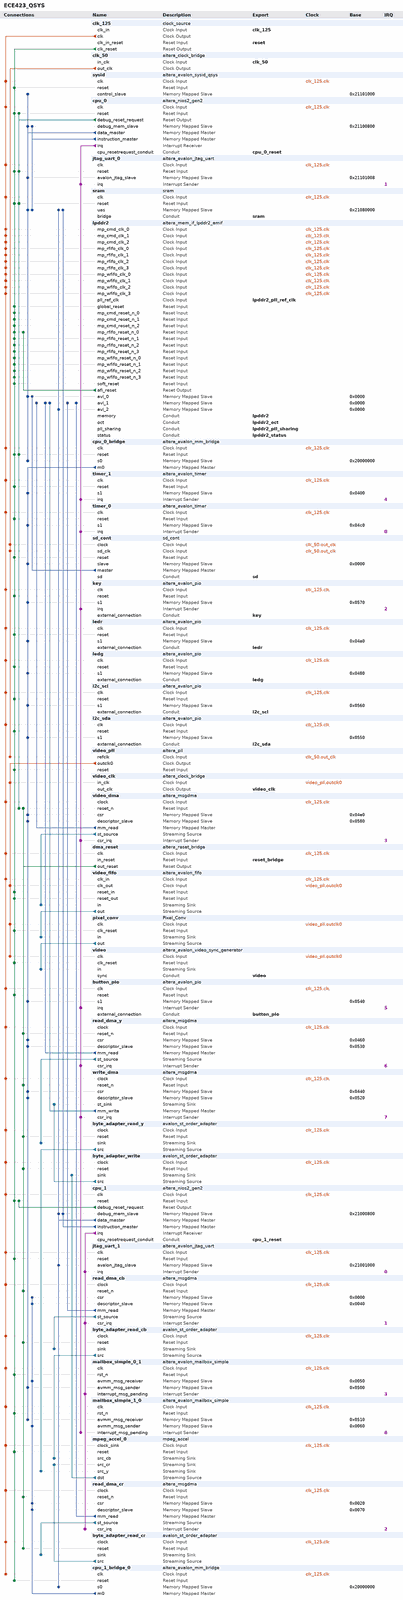
[diagram p0: system contents, whole]
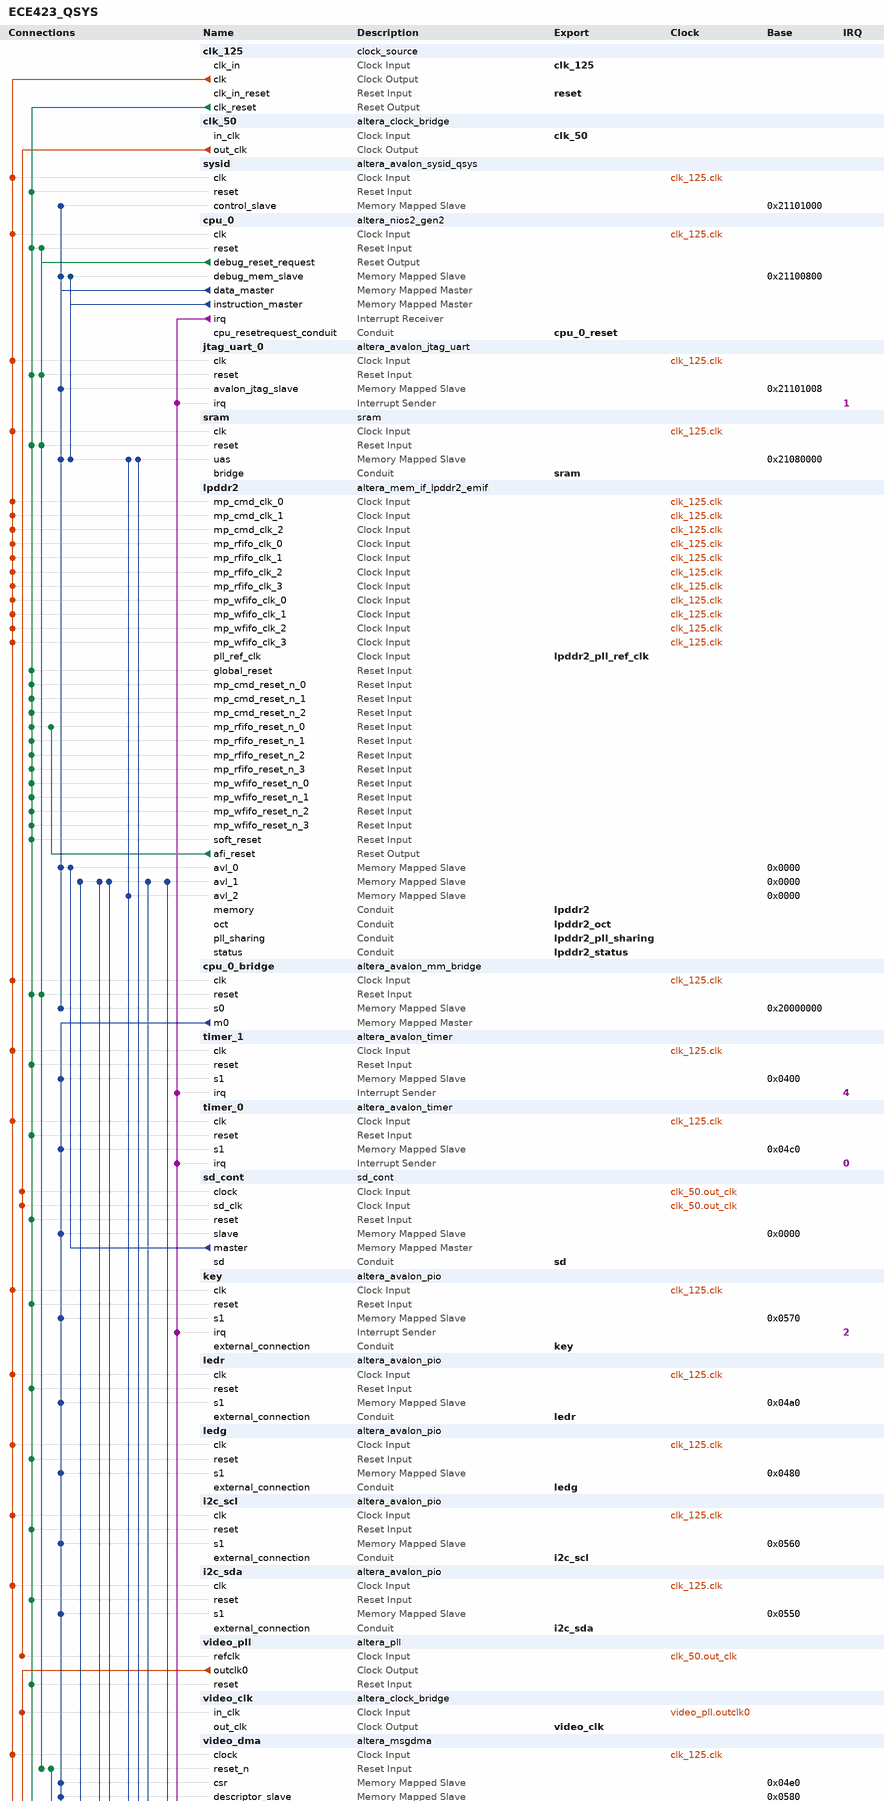
[diagram p1: system contents, upper part]
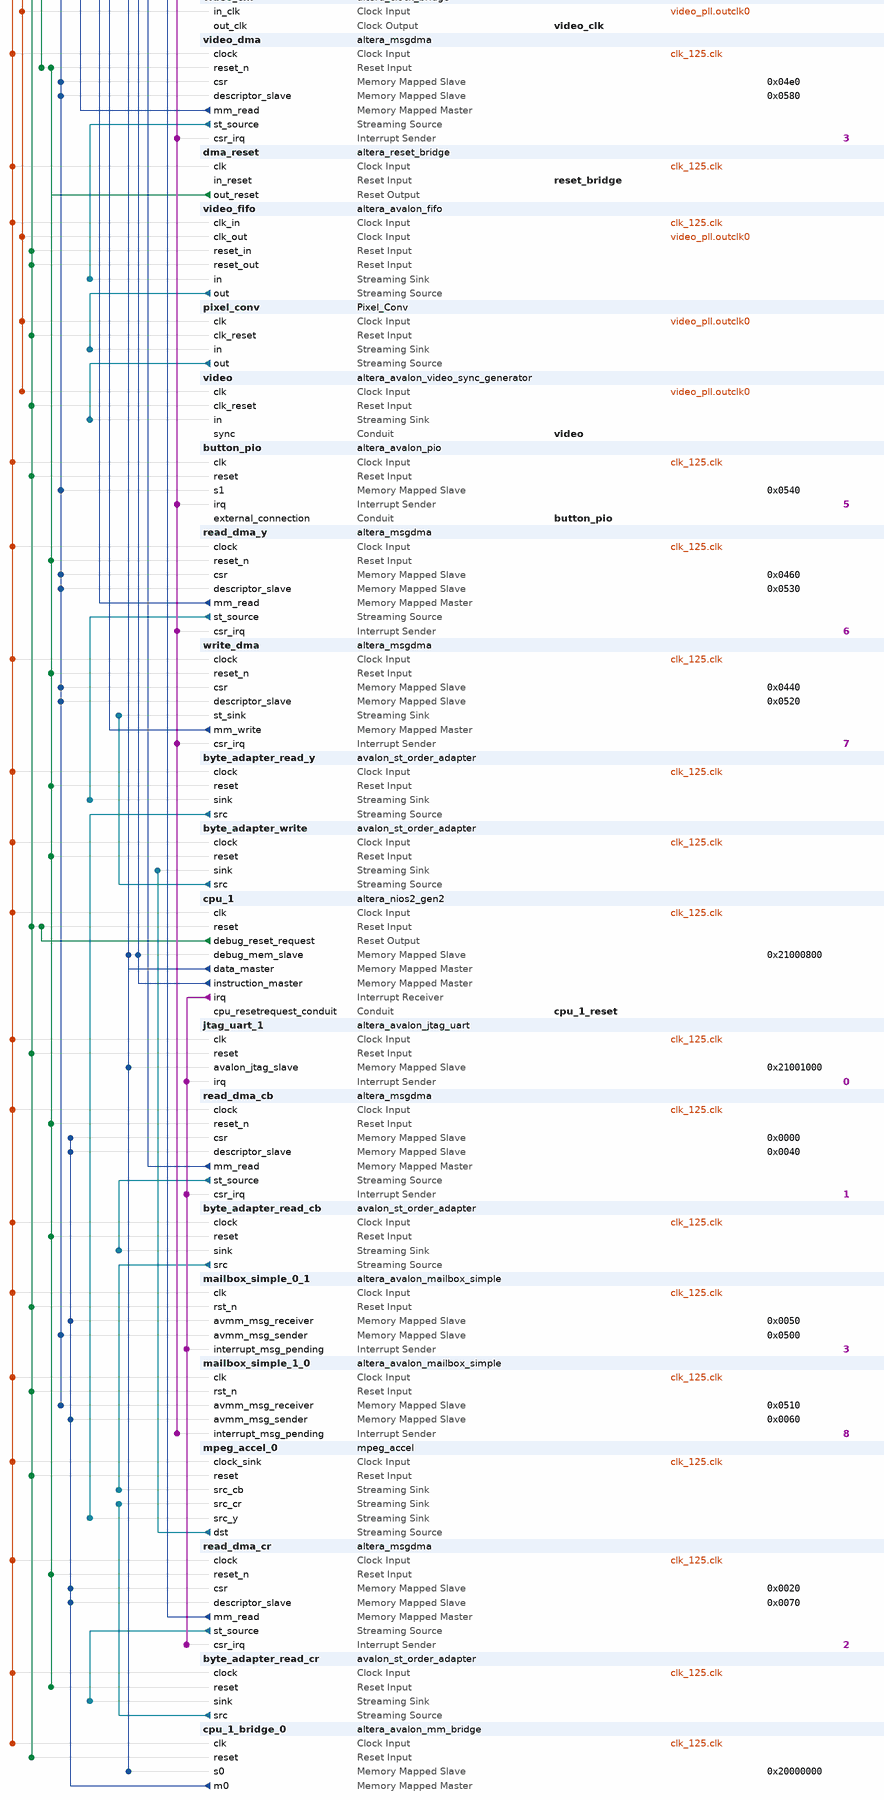
[diagram p2: system contents, lower part]
# Platform Designer (Qsys) system ECE423_QSYS, Cyclone V 5CGXFC5C6F27C7
# Parameters at their usual value, and those the tool derives, are not listed.
package require -exact qsys 15.1
create_system ECE423_QSYS
set_project_property DEVICE_FAMILY {Cyclone V}
set_project_property DEVICE 5CGXFC5C6F27C7

add_instance clk_125 clock_source 15.1
set_instance_parameter_value clk_125 clockFrequency 125000000

add_instance clk_50 altera_clock_bridge 15.1
set_instance_parameter_value clk_50 DERIVED_CLOCK_RATE 0
set_instance_parameter_value clk_50 EXPLICIT_CLOCK_RATE 0

add_instance sysid altera_avalon_sysid_qsys 15.1
set_instance_parameter_value sysid id 0

add_instance cpu_0 altera_nios2_gen2 15.1
set_instance_parameter_value cpu_0 cpuReset true
set_instance_parameter_value cpu_0 dcache_bursts true
set_instance_parameter_value cpu_0 dcache_size 16384
set_instance_parameter_value cpu_0 dividerType srt2
set_instance_parameter_value cpu_0 exceptionSlave sram_memory.uas
set_instance_parameter_value cpu_0 icache_size 4096
set_instance_parameter_value cpu_0 impl Fast
set_instance_parameter_value cpu_0 resetSlave sram_memory.uas
set_instance_parameter_value cpu_0 setting_activateTrace true

add_instance jtag_uart_0 altera_avalon_jtag_uart 15.1
set_instance_parameter_value jtag_uart_0 simInteractiveOptions NO_INTERACTIVE_WINDOWS

add_instance sram sram 1.0

add_instance lpddr2 altera_mem_if_lpddr2_emif 15.1
set_instance_parameter_value lpddr2 ABSTRACT_REAL_COMPARE_TEST false
set_instance_parameter_value lpddr2 ABS_RAM_MEM_INIT_FILENAME meminit
set_instance_parameter_value lpddr2 ACV_PHY_CLK_ADD_FR_PHASE 0.0
set_instance_parameter_value lpddr2 AC_PACKAGE_DESKEW false
set_instance_parameter_value lpddr2 AC_ROM_USER_ADD_0 0_0000_0000_0000
set_instance_parameter_value lpddr2 AC_ROM_USER_ADD_1 0_0000_0000_1000
set_instance_parameter_value lpddr2 ADDR_ORDER 0
set_instance_parameter_value lpddr2 ADD_EFFICIENCY_MONITOR false
set_instance_parameter_value lpddr2 ADD_EXTERNAL_SEQ_DEBUG_NIOS false
set_instance_parameter_value lpddr2 ADVANCED_CK_PHASES false
set_instance_parameter_value lpddr2 ADVERTIZE_SEQUENCER_SW_BUILD_FILES false
set_instance_parameter_value lpddr2 AFI_DEBUG_INFO_WIDTH 32
set_instance_parameter_value lpddr2 ALTMEMPHY_COMPATIBLE_MODE false
set_instance_parameter_value lpddr2 AP_MODE false
set_instance_parameter_value lpddr2 AP_MODE_EN 0
set_instance_parameter_value lpddr2 AVL_DATA_WIDTH_PORT 32,128,32,128,32,32
set_instance_parameter_value lpddr2 AVL_MAX_SIZE 128
set_instance_parameter_value lpddr2 BYTE_ENABLE true
set_instance_parameter_value lpddr2 C2P_WRITE_CLOCK_ADD_PHASE 0.0
set_instance_parameter_value lpddr2 CALIBRATION_MODE Full
set_instance_parameter_value lpddr2 CALIB_REG_WIDTH 8
set_instance_parameter_value lpddr2 CFG_DATA_REORDERING_TYPE INTER_BANK
set_instance_parameter_value lpddr2 CFG_REORDER_DATA true
set_instance_parameter_value lpddr2 CFG_TCCD_NS 2.5
set_instance_parameter_value lpddr2 COMMAND_PHASE 0.0
set_instance_parameter_value lpddr2 CONTROLLER_LATENCY 5
set_instance_parameter_value lpddr2 CORE_DEBUG_CONNECTION EXPORT
set_instance_parameter_value lpddr2 CPORT_TYPE_PORT Bidirectional,Bidirectional,Bidirectional,Read-only,Bidirectional,Bidirectional
set_instance_parameter_value lpddr2 CTL_AUTOPCH_EN false
set_instance_parameter_value lpddr2 CTL_CMD_QUEUE_DEPTH 8
set_instance_parameter_value lpddr2 CTL_CSR_CONNECTION INTERNAL_JTAG
set_instance_parameter_value lpddr2 CTL_CSR_ENABLED false
set_instance_parameter_value lpddr2 CTL_CSR_READ_ONLY 1
set_instance_parameter_value lpddr2 CTL_DEEP_POWERDN_EN false
set_instance_parameter_value lpddr2 CTL_DYNAMIC_BANK_ALLOCATION false
set_instance_parameter_value lpddr2 CTL_DYNAMIC_BANK_NUM 4
set_instance_parameter_value lpddr2 CTL_ECC_AUTO_CORRECTION_ENABLED false
set_instance_parameter_value lpddr2 CTL_ECC_ENABLED false
set_instance_parameter_value lpddr2 CTL_ENABLE_BURST_INTERRUPT false
set_instance_parameter_value lpddr2 CTL_ENABLE_BURST_TERMINATE false
set_instance_parameter_value lpddr2 CTL_HRB_ENABLED false
set_instance_parameter_value lpddr2 CTL_LOOK_AHEAD_DEPTH 4
set_instance_parameter_value lpddr2 CTL_SELF_REFRESH_EN false
set_instance_parameter_value lpddr2 CTL_USR_REFRESH_EN false
set_instance_parameter_value lpddr2 CTL_ZQCAL_EN false
set_instance_parameter_value lpddr2 CUT_NEW_FAMILY_TIMING true
set_instance_parameter_value lpddr2 DAT_DATA_WIDTH 32
set_instance_parameter_value lpddr2 DEBUG_MODE false
set_instance_parameter_value lpddr2 DEVICE_DEPTH 1
set_instance_parameter_value lpddr2 DISABLE_CHILD_MESSAGING false
set_instance_parameter_value lpddr2 DISCRETE_FLY_BY true
set_instance_parameter_value lpddr2 DLL_SHARING_MODE None
set_instance_parameter_value lpddr2 DQS_DQSN_MODE DIFFERENTIAL
set_instance_parameter_value lpddr2 DQ_INPUT_REG_USE_CLKN false
set_instance_parameter_value lpddr2 DUPLICATE_AC false
set_instance_parameter_value lpddr2 ED_EXPORT_SEQ_DEBUG false
set_instance_parameter_value lpddr2 ENABLE_ABS_RAM_MEM_INIT false
set_instance_parameter_value lpddr2 ENABLE_BONDING false
set_instance_parameter_value lpddr2 ENABLE_BURST_MERGE false
set_instance_parameter_value lpddr2 ENABLE_CTRL_AVALON_INTERFACE true
set_instance_parameter_value lpddr2 ENABLE_DELAY_CHAIN_WRITE false
set_instance_parameter_value lpddr2 ENABLE_EMIT_BFM_MASTER false
set_instance_parameter_value lpddr2 ENABLE_EXPORT_SEQ_DEBUG_BRIDGE false
set_instance_parameter_value lpddr2 ENABLE_EXTRA_REPORTING false
set_instance_parameter_value lpddr2 ENABLE_ISS_PROBES false
set_instance_parameter_value lpddr2 ENABLE_NON_DESTRUCTIVE_CALIB false
set_instance_parameter_value lpddr2 ENABLE_NON_DES_CAL false
set_instance_parameter_value lpddr2 ENABLE_NON_DES_CAL_TEST false
set_instance_parameter_value lpddr2 ENABLE_SEQUENCER_MARGINING_ON_BY_DEFAULT false
set_instance_parameter_value lpddr2 ENABLE_USER_ECC false
set_instance_parameter_value lpddr2 EXPORT_AFI_HALF_CLK false
set_instance_parameter_value lpddr2 FORCED_NON_LDC_ADDR_CMD_MEM_CK_INVERT false
set_instance_parameter_value lpddr2 FORCED_NUM_WRITE_FR_CYCLE_SHIFTS 0
set_instance_parameter_value lpddr2 FORCE_DQS_TRACKING AUTO
set_instance_parameter_value lpddr2 FORCE_MAX_LATENCY_COUNT_WIDTH 0
set_instance_parameter_value lpddr2 FORCE_SEQUENCER_TCL_DEBUG_MODE false
set_instance_parameter_value lpddr2 FORCE_SHADOW_REGS AUTO
set_instance_parameter_value lpddr2 HARD_EMIF true
set_instance_parameter_value lpddr2 HCX_COMPAT_MODE false
set_instance_parameter_value lpddr2 HHP_HPS false
set_instance_parameter_value lpddr2 HHP_HPS_SIMULATION false
set_instance_parameter_value lpddr2 HHP_HPS_VERIFICATION false
set_instance_parameter_value lpddr2 HPS_PROTOCOL DEFAULT
set_instance_parameter_value lpddr2 INCLUDE_BOARD_DELAY_MODEL false
set_instance_parameter_value lpddr2 INCLUDE_MULTIRANK_BOARD_DELAY_MODEL false
set_instance_parameter_value lpddr2 IS_ES_DEVICE false
set_instance_parameter_value lpddr2 LOCAL_ID_WIDTH 8
set_instance_parameter_value lpddr2 MARGIN_VARIATION_TEST false
set_instance_parameter_value lpddr2 MAX_PENDING_RD_CMD 16
set_instance_parameter_value lpddr2 MAX_PENDING_WR_CMD 8
set_instance_parameter_value lpddr2 MEM_ATCL 0
set_instance_parameter_value lpddr2 MEM_AUTO_LEVELING_MODE true
set_instance_parameter_value lpddr2 MEM_BANKADDR_WIDTH 3
set_instance_parameter_value lpddr2 MEM_BL 8
set_instance_parameter_value lpddr2 MEM_BT Sequential
set_instance_parameter_value lpddr2 MEM_CK_PHASE 0.0
set_instance_parameter_value lpddr2 MEM_CK_WIDTH 1
set_instance_parameter_value lpddr2 MEM_CLK_EN_WIDTH 1
set_instance_parameter_value lpddr2 MEM_CLK_FREQ 330.0
set_instance_parameter_value lpddr2 MEM_CLK_FREQ_MAX 400.0
set_instance_parameter_value lpddr2 MEM_COL_ADDR_WIDTH 10
set_instance_parameter_value lpddr2 MEM_CS_WIDTH 1
set_instance_parameter_value lpddr2 MEM_DEVICE MISSING_MODEL
set_instance_parameter_value lpddr2 MEM_DLL_EN true
set_instance_parameter_value lpddr2 MEM_DQ_PER_DQS 8
set_instance_parameter_value lpddr2 MEM_DQ_WIDTH 32
set_instance_parameter_value lpddr2 MEM_DRV_STR 40
set_instance_parameter_value lpddr2 MEM_FORMAT DISCRETE
set_instance_parameter_value lpddr2 MEM_GUARANTEED_WRITE_INIT false
set_instance_parameter_value lpddr2 MEM_IF_BOARD_BASE_DELAY 10
set_instance_parameter_value lpddr2 MEM_IF_DM_PINS_EN true
set_instance_parameter_value lpddr2 MEM_IF_DQSN_EN true
set_instance_parameter_value lpddr2 MEM_IF_SIM_VALID_WINDOW 0
set_instance_parameter_value lpddr2 MEM_INIT_EN false
set_instance_parameter_value lpddr2 MEM_MIRROR_ADDRESSING 0
set_instance_parameter_value lpddr2 MEM_NUMBER_OF_DIMMS 1
set_instance_parameter_value lpddr2 MEM_NUMBER_OF_RANKS_PER_DEVICE 1
set_instance_parameter_value lpddr2 MEM_NUMBER_OF_RANKS_PER_DIMM 1
set_instance_parameter_value lpddr2 MEM_RANK_MULTIPLICATION_FACTOR 1
set_instance_parameter_value lpddr2 MEM_ROW_ADDR_WIDTH 14
set_instance_parameter_value lpddr2 MEM_TCL 7
set_instance_parameter_value lpddr2 MEM_TFAW_NS 50.0
set_instance_parameter_value lpddr2 MEM_TINIT_US 200
set_instance_parameter_value lpddr2 MEM_TMRD_CK 2
set_instance_parameter_value lpddr2 MEM_TRAS_NS 70.0
set_instance_parameter_value lpddr2 MEM_TRCD_NS 18.0
set_instance_parameter_value lpddr2 MEM_TREFI_US 3.9
set_instance_parameter_value lpddr2 MEM_TRFC_NS 60.0
set_instance_parameter_value lpddr2 MEM_TRP_NS 18.0
set_instance_parameter_value lpddr2 MEM_TRRD_NS 10.0
set_instance_parameter_value lpddr2 MEM_TRTP_NS 7.5
set_instance_parameter_value lpddr2 MEM_TWR_NS 15.0
set_instance_parameter_value lpddr2 MEM_TWTR 2
set_instance_parameter_value lpddr2 MEM_USER_LEVELING_MODE Leveling
set_instance_parameter_value lpddr2 MEM_VENDOR Micron
set_instance_parameter_value lpddr2 MEM_VERBOSE true
set_instance_parameter_value lpddr2 MRS_MIRROR_PING_PONG_ATSO false
set_instance_parameter_value lpddr2 MULTICAST_EN false
set_instance_parameter_value lpddr2 NEXTGEN true
set_instance_parameter_value lpddr2 NIOS_ROM_DATA_WIDTH 32
set_instance_parameter_value lpddr2 NUM_DLL_SHARING_INTERFACES 1
set_instance_parameter_value lpddr2 NUM_EXTRA_REPORT_PATH 10
set_instance_parameter_value lpddr2 NUM_OCT_SHARING_INTERFACES 1
set_instance_parameter_value lpddr2 NUM_OF_PORTS 3
set_instance_parameter_value lpddr2 NUM_PLL_SHARING_INTERFACES 1
set_instance_parameter_value lpddr2 OCT_SHARING_MODE None
set_instance_parameter_value lpddr2 P2C_READ_CLOCK_ADD_PHASE 0.0
set_instance_parameter_value lpddr2 PACKAGE_DESKEW false
set_instance_parameter_value lpddr2 PARSE_FRIENDLY_DEVICE_FAMILY_PARAM_VALID false
set_instance_parameter_value lpddr2 PHY_CSR_CONNECTION INTERNAL_JTAG
set_instance_parameter_value lpddr2 PHY_CSR_ENABLED false
set_instance_parameter_value lpddr2 PHY_ONLY false
set_instance_parameter_value lpddr2 PINGPONGPHY_EN false
set_instance_parameter_value lpddr2 PLL_ADDR_CMD_CLK_DIV_PARAM 0
set_instance_parameter_value lpddr2 PLL_ADDR_CMD_CLK_FREQ_PARAM 0.0
set_instance_parameter_value lpddr2 PLL_ADDR_CMD_CLK_MULT_PARAM 0
set_instance_parameter_value lpddr2 PLL_ADDR_CMD_CLK_PHASE_PS_PARAM 0
set_instance_parameter_value lpddr2 PLL_AFI_CLK_DIV_PARAM 0
set_instance_parameter_value lpddr2 PLL_AFI_CLK_FREQ_PARAM 0.0
set_instance_parameter_value lpddr2 PLL_AFI_CLK_MULT_PARAM 0
set_instance_parameter_value lpddr2 PLL_AFI_CLK_PHASE_PS_PARAM 0
set_instance_parameter_value lpddr2 PLL_AFI_HALF_CLK_DIV_PARAM 0
set_instance_parameter_value lpddr2 PLL_AFI_HALF_CLK_FREQ_PARAM 0.0
set_instance_parameter_value lpddr2 PLL_AFI_HALF_CLK_MULT_PARAM 0
set_instance_parameter_value lpddr2 PLL_AFI_HALF_CLK_PHASE_PS_PARAM 0
set_instance_parameter_value lpddr2 PLL_AFI_PHY_CLK_DIV_PARAM 0
set_instance_parameter_value lpddr2 PLL_AFI_PHY_CLK_FREQ_PARAM 0.0
set_instance_parameter_value lpddr2 PLL_AFI_PHY_CLK_MULT_PARAM 0
set_instance_parameter_value lpddr2 PLL_AFI_PHY_CLK_PHASE_PS_PARAM 0
set_instance_parameter_value lpddr2 PLL_C2P_WRITE_CLK_DIV_PARAM 0
set_instance_parameter_value lpddr2 PLL_C2P_WRITE_CLK_FREQ_PARAM 0.0
set_instance_parameter_value lpddr2 PLL_C2P_WRITE_CLK_MULT_PARAM 0
set_instance_parameter_value lpddr2 PLL_C2P_WRITE_CLK_PHASE_PS_PARAM 0
set_instance_parameter_value lpddr2 PLL_CLK_PARAM_VALID false
set_instance_parameter_value lpddr2 PLL_CONFIG_CLK_DIV_PARAM 0
set_instance_parameter_value lpddr2 PLL_CONFIG_CLK_FREQ_PARAM 0.0
set_instance_parameter_value lpddr2 PLL_CONFIG_CLK_MULT_PARAM 0
set_instance_parameter_value lpddr2 PLL_CONFIG_CLK_PHASE_PS_PARAM 0
set_instance_parameter_value lpddr2 PLL_DR_CLK_DIV_PARAM 0
set_instance_parameter_value lpddr2 PLL_DR_CLK_FREQ_PARAM 0.0
set_instance_parameter_value lpddr2 PLL_DR_CLK_MULT_PARAM 0
set_instance_parameter_value lpddr2 PLL_DR_CLK_PHASE_PS_PARAM 0
set_instance_parameter_value lpddr2 PLL_HR_CLK_DIV_PARAM 0
set_instance_parameter_value lpddr2 PLL_HR_CLK_FREQ_PARAM 0.0
set_instance_parameter_value lpddr2 PLL_HR_CLK_MULT_PARAM 0
set_instance_parameter_value lpddr2 PLL_HR_CLK_PHASE_PS_PARAM 0
set_instance_parameter_value lpddr2 PLL_LOCATION Top_Bottom
set_instance_parameter_value lpddr2 PLL_MEM_CLK_DIV_PARAM 0
set_instance_parameter_value lpddr2 PLL_MEM_CLK_FREQ_PARAM 0.0
set_instance_parameter_value lpddr2 PLL_MEM_CLK_MULT_PARAM 0
set_instance_parameter_value lpddr2 PLL_MEM_CLK_PHASE_PS_PARAM 0
set_instance_parameter_value lpddr2 PLL_NIOS_CLK_DIV_PARAM 0
set_instance_parameter_value lpddr2 PLL_NIOS_CLK_FREQ_PARAM 0.0
set_instance_parameter_value lpddr2 PLL_NIOS_CLK_MULT_PARAM 0
set_instance_parameter_value lpddr2 PLL_NIOS_CLK_PHASE_PS_PARAM 0
set_instance_parameter_value lpddr2 PLL_P2C_READ_CLK_DIV_PARAM 0
set_instance_parameter_value lpddr2 PLL_P2C_READ_CLK_FREQ_PARAM 0.0
set_instance_parameter_value lpddr2 PLL_P2C_READ_CLK_MULT_PARAM 0
set_instance_parameter_value lpddr2 PLL_P2C_READ_CLK_PHASE_PS_PARAM 0
set_instance_parameter_value lpddr2 PLL_SHARING_MODE None
set_instance_parameter_value lpddr2 PLL_WRITE_CLK_DIV_PARAM 0
set_instance_parameter_value lpddr2 PLL_WRITE_CLK_FREQ_PARAM 0.0
set_instance_parameter_value lpddr2 PLL_WRITE_CLK_MULT_PARAM 0
set_instance_parameter_value lpddr2 PLL_WRITE_CLK_PHASE_PS_PARAM 0
set_instance_parameter_value lpddr2 POWER_OF_TWO_BUS false
set_instance_parameter_value lpddr2 PRIORITY_PORT 2,3,1,3,1,1
set_instance_parameter_value lpddr2 RATE Full
set_instance_parameter_value lpddr2 READ_DQ_DQS_CLOCK_SOURCE INVERTED_DQS_BUS
set_instance_parameter_value lpddr2 READ_FIFO_SIZE 8
set_instance_parameter_value lpddr2 REFRESH_BURST_VALIDATION false
set_instance_parameter_value lpddr2 REFRESH_INTERVAL 15000
set_instance_parameter_value lpddr2 REF_CLK_FREQ 50.0
set_instance_parameter_value lpddr2 REF_CLK_FREQ_MAX_PARAM 0.0
set_instance_parameter_value lpddr2 REF_CLK_FREQ_MIN_PARAM 0.0
set_instance_parameter_value lpddr2 REF_CLK_FREQ_PARAM_VALID false
set_instance_parameter_value lpddr2 SEQUENCER_TYPE NIOS
set_instance_parameter_value lpddr2 SEQ_MODE 0
set_instance_parameter_value lpddr2 SKIP_MEM_INIT true
set_instance_parameter_value lpddr2 SOPC_COMPAT_RESET false
set_instance_parameter_value lpddr2 SPEED_GRADE 7
set_instance_parameter_value lpddr2 STARVE_LIMIT 10
set_instance_parameter_value lpddr2 TIMING_BOARD_AC_EYE_REDUCTION_H 0.0
set_instance_parameter_value lpddr2 TIMING_BOARD_AC_EYE_REDUCTION_SU 0.0
set_instance_parameter_value lpddr2 TIMING_BOARD_AC_SKEW 0.02
set_instance_parameter_value lpddr2 TIMING_BOARD_AC_SLEW_RATE 1.0
set_instance_parameter_value lpddr2 TIMING_BOARD_AC_TO_CK_SKEW 0.0
set_instance_parameter_value lpddr2 TIMING_BOARD_CK_CKN_SLEW_RATE 2.0
set_instance_parameter_value lpddr2 TIMING_BOARD_DELTA_DQS_ARRIVAL_TIME 0.0
set_instance_parameter_value lpddr2 TIMING_BOARD_DELTA_READ_DQS_ARRIVAL_TIME 0.0
set_instance_parameter_value lpddr2 TIMING_BOARD_DERATE_METHOD AUTO
set_instance_parameter_value lpddr2 TIMING_BOARD_DQS_DQSN_SLEW_RATE 2.0
set_instance_parameter_value lpddr2 TIMING_BOARD_DQ_EYE_REDUCTION 0.0
set_instance_parameter_value lpddr2 TIMING_BOARD_DQ_SLEW_RATE 1.0
set_instance_parameter_value lpddr2 TIMING_BOARD_DQ_TO_DQS_SKEW 0.0
set_instance_parameter_value lpddr2 TIMING_BOARD_ISI_METHOD AUTO
set_instance_parameter_value lpddr2 TIMING_BOARD_MAX_CK_DELAY 0.33
set_instance_parameter_value lpddr2 TIMING_BOARD_MAX_DQS_DELAY 0.34
set_instance_parameter_value lpddr2 TIMING_BOARD_READ_DQ_EYE_REDUCTION 0.0
set_instance_parameter_value lpddr2 TIMING_BOARD_SKEW_BETWEEN_DIMMS 0.05
set_instance_parameter_value lpddr2 TIMING_BOARD_SKEW_BETWEEN_DQS 0.02
set_instance_parameter_value lpddr2 TIMING_BOARD_SKEW_CKDQS_DIMM_MAX 0.01
set_instance_parameter_value lpddr2 TIMING_BOARD_SKEW_CKDQS_DIMM_MIN -0.01
set_instance_parameter_value lpddr2 TIMING_BOARD_SKEW_WITHIN_DQS 0.02
set_instance_parameter_value lpddr2 TIMING_BOARD_TDH 0.0
set_instance_parameter_value lpddr2 TIMING_BOARD_TDS 0.0
set_instance_parameter_value lpddr2 TIMING_BOARD_TIH 0.0
set_instance_parameter_value lpddr2 TIMING_BOARD_TIS 0.0
set_instance_parameter_value lpddr2 TIMING_TDH 270
set_instance_parameter_value lpddr2 TIMING_TDQSCK 5500
set_instance_parameter_value lpddr2 TIMING_TDQSCKDL 1200
set_instance_parameter_value lpddr2 TIMING_TDQSCKDM 900
set_instance_parameter_value lpddr2 TIMING_TDQSCKDS 450
set_instance_parameter_value lpddr2 TIMING_TDQSH 0.4
set_instance_parameter_value lpddr2 TIMING_TDQSQ 240
set_instance_parameter_value lpddr2 TIMING_TDQSS 1.0
set_instance_parameter_value lpddr2 TIMING_TDS 270
set_instance_parameter_value lpddr2 TIMING_TDSH 0.2
set_instance_parameter_value lpddr2 TIMING_TDSS 0.2
set_instance_parameter_value lpddr2 TIMING_TIH 290
set_instance_parameter_value lpddr2 TIMING_TIS 290
set_instance_parameter_value lpddr2 TIMING_TQHS 280
set_instance_parameter_value lpddr2 TRACKING_ERROR_TEST false
set_instance_parameter_value lpddr2 TRACKING_WATCH_TEST false
set_instance_parameter_value lpddr2 TREFI 35100
set_instance_parameter_value lpddr2 TRFC 350
set_instance_parameter_value lpddr2 USER_DEBUG_LEVEL 0
set_instance_parameter_value lpddr2 USE_AXI_ADAPTOR false
set_instance_parameter_value lpddr2 USE_FAKE_PHY false
set_instance_parameter_value lpddr2 USE_MEM_CLK_FREQ false
set_instance_parameter_value lpddr2 USE_MM_ADAPTOR true
set_instance_parameter_value lpddr2 USE_SEQUENCER_BFM false
set_instance_parameter_value lpddr2 WEIGHT_PORT 0,0,0,0,0,0
set_instance_parameter_value lpddr2 WRBUFFER_ADDR_WIDTH 6

add_instance cpu_0_bridge altera_avalon_mm_bridge 15.1
set_instance_parameter_value cpu_0_bridge ADDRESS_UNITS SYMBOLS
set_instance_parameter_value cpu_0_bridge ADDRESS_WIDTH 10
set_instance_parameter_value cpu_0_bridge DATA_WIDTH 32
set_instance_parameter_value cpu_0_bridge MAX_PENDING_RESPONSES 4
set_instance_parameter_value cpu_0_bridge USE_AUTO_ADDRESS_WIDTH 1

add_instance timer_1 altera_avalon_timer 15.1
set_instance_parameter_value timer_1 counterSize 64
set_instance_parameter_value timer_1 period 1
set_instance_parameter_value timer_1 periodUnits USEC

add_instance timer_0 altera_avalon_timer 15.1
set_instance_parameter_value timer_0 period 1
set_instance_parameter_value timer_0 periodUnits MSEC

add_instance sd_cont sd_cont 1.0

add_instance key altera_avalon_pio 15.1
set_instance_parameter_value key captureEdge true
set_instance_parameter_value key direction Input
set_instance_parameter_value key edgeType FALLING
set_instance_parameter_value key generateIRQ true
set_instance_parameter_value key irqType EDGE
set_instance_parameter_value key width 4

add_instance ledr altera_avalon_pio 15.1
set_instance_parameter_value ledr bitModifyingOutReg true
set_instance_parameter_value ledr direction Output
set_instance_parameter_value ledr width 8

add_instance ledg altera_avalon_pio 15.1
set_instance_parameter_value ledg bitModifyingOutReg true
set_instance_parameter_value ledg direction Output
set_instance_parameter_value ledg width 8

add_instance i2c_scl altera_avalon_pio 15.1
set_instance_parameter_value i2c_scl direction Output
set_instance_parameter_value i2c_scl width 1

add_instance i2c_sda altera_avalon_pio 15.1
set_instance_parameter_value i2c_sda direction Bidir
set_instance_parameter_value i2c_sda width 1

add_instance video_pll altera_pll 15.1
set_instance_parameter_value video_pll gui_device_speed_grade 1
set_instance_parameter_value video_pll gui_number_of_clocks 1
set_instance_parameter_value video_pll gui_operation_mode direct
set_instance_parameter_value video_pll gui_output_clock_frequency0 25.175
set_instance_parameter_value video_pll gui_pll_mode {Integer-N PLL}
set_instance_parameter_value video_pll gui_reference_clock_frequency 50.0
set_instance_parameter_value video_pll gui_use_locked false

add_instance video_clk altera_clock_bridge 15.1
set_instance_parameter_value video_clk DERIVED_CLOCK_RATE 25175644
set_instance_parameter_value video_clk EXPLICIT_CLOCK_RATE 0

add_instance video_dma altera_msgdma 15.1
set_instance_parameter_value video_dma BURST_ENABLE 1
set_instance_parameter_value video_dma BURST_WRAPPING_SUPPORT 1
set_instance_parameter_value video_dma DATA_FIFO_DEPTH 512
set_instance_parameter_value video_dma DATA_WIDTH 128
set_instance_parameter_value video_dma DESCRIPTOR_FIFO_DEPTH 32
set_instance_parameter_value video_dma ENHANCED_FEATURES 0
set_instance_parameter_value video_dma ERROR_ENABLE 0
set_instance_parameter_value video_dma MAX_BURST_COUNT 128
set_instance_parameter_value video_dma MAX_BYTE 2097152
set_instance_parameter_value video_dma MODE 1
set_instance_parameter_value video_dma PACKET_ENABLE 1
set_instance_parameter_value video_dma TRANSFER_TYPE {Full Word Accesses Only}

add_instance dma_reset altera_reset_bridge 15.1
set_instance_parameter_value dma_reset ACTIVE_LOW_RESET 0
set_instance_parameter_value dma_reset SYNCHRONOUS_EDGES deassert

add_instance video_fifo altera_avalon_fifo 15.1
set_instance_parameter_value video_fifo bitsPerSymbol 8
set_instance_parameter_value video_fifo channelWidth 0
set_instance_parameter_value video_fifo errorWidth 0
set_instance_parameter_value video_fifo fifoDepth 256
set_instance_parameter_value video_fifo fifoInputInterfaceOptions AVALONST_SINK
set_instance_parameter_value video_fifo fifoOutputInterfaceOptions AVALONST_SOURCE
set_instance_parameter_value video_fifo singleClockMode false
set_instance_parameter_value video_fifo symbolsPerBeat 4
set_instance_parameter_value video_fifo useIRQ true
set_instance_parameter_value video_fifo usePacket true
set_instance_parameter_value video_fifo useReadControl false
set_instance_parameter_value video_fifo useWriteControl false

add_instance pixel_conv Pixel_Conv 1.0
set_instance_parameter_value pixel_conv SOURCE_SYMBOLS_PER_BEAT 1

add_instance video altera_avalon_video_sync_generator 15.1
set_instance_parameter_value video BEATS_PER_PIXEL 1
set_instance_parameter_value video DATA_STREAM_BIT_WIDTH 24
set_instance_parameter_value video H_BLANK_PIXELS 128
set_instance_parameter_value video H_FRONT_PORCH_PIXELS 24
set_instance_parameter_value video H_SYNC_PULSE_PIXELS 32
set_instance_parameter_value video H_SYNC_PULSE_POLARITY 0
set_instance_parameter_value video NUM_COLUMNS 640
set_instance_parameter_value video NUM_ROWS 480
set_instance_parameter_value video TOTAL_HSCAN_PIXELS 768
set_instance_parameter_value video TOTAL_VSCAN_LINES 525
set_instance_parameter_value video V_BLANK_LINES 45
set_instance_parameter_value video V_FRONT_PORCH_LINES 10
set_instance_parameter_value video V_SYNC_PULSE_LINES 3
set_instance_parameter_value video V_SYNC_PULSE_POLARITY 0

add_instance button_pio altera_avalon_pio 15.1
set_instance_parameter_value button_pio captureEdge true
set_instance_parameter_value button_pio direction Input
set_instance_parameter_value button_pio edgeType ANY
set_instance_parameter_value button_pio generateIRQ true
set_instance_parameter_value button_pio irqType EDGE
set_instance_parameter_value button_pio width 4

add_instance read_dma_y altera_msgdma 15.1
set_instance_parameter_value read_dma_y BURST_ENABLE 1
set_instance_parameter_value read_dma_y DATA_FIFO_DEPTH 512
set_instance_parameter_value read_dma_y DATA_WIDTH 1024
set_instance_parameter_value read_dma_y DESCRIPTOR_FIFO_DEPTH 16
set_instance_parameter_value read_dma_y ENHANCED_FEATURES 0
set_instance_parameter_value read_dma_y ERROR_ENABLE 0
set_instance_parameter_value read_dma_y MAX_BURST_COUNT 4
set_instance_parameter_value read_dma_y MAX_BYTE 1048576
set_instance_parameter_value read_dma_y MODE 1
set_instance_parameter_value read_dma_y PACKET_ENABLE 0
set_instance_parameter_value read_dma_y TRANSFER_TYPE {Full Word Accesses Only}

add_instance write_dma altera_msgdma 15.1
set_instance_parameter_value write_dma BURST_ENABLE 1
set_instance_parameter_value write_dma DATA_FIFO_DEPTH 16
set_instance_parameter_value write_dma DATA_WIDTH 1024
set_instance_parameter_value write_dma DESCRIPTOR_FIFO_DEPTH 128
set_instance_parameter_value write_dma ENHANCED_FEATURES 0
set_instance_parameter_value write_dma ERROR_ENABLE 0
set_instance_parameter_value write_dma MAX_BURST_COUNT 4
set_instance_parameter_value write_dma MAX_BYTE 1048576
set_instance_parameter_value write_dma MODE 2
set_instance_parameter_value write_dma PACKET_ENABLE 0
set_instance_parameter_value write_dma TRANSFER_TYPE {Full Word Accesses Only}

add_instance byte_adapter_read_y avalon_st_order_adapter 1.0
set_instance_parameter_value byte_adapter_read_y Width 1024

add_instance byte_adapter_write avalon_st_order_adapter 1.0
set_instance_parameter_value byte_adapter_write Width 1024

add_instance cpu_1 altera_nios2_gen2 15.1
set_instance_parameter_value cpu_1 cpuReset true
set_instance_parameter_value cpu_1 dcache_bursts true
set_instance_parameter_value cpu_1 dcache_size 16384
set_instance_parameter_value cpu_1 dividerType srt2
set_instance_parameter_value cpu_1 exceptionOffset 262176
set_instance_parameter_value cpu_1 exceptionSlave sram_memory.uas
set_instance_parameter_value cpu_1 icache_size 4096
set_instance_parameter_value cpu_1 impl Fast
set_instance_parameter_value cpu_1 resetOffset 262144
set_instance_parameter_value cpu_1 resetSlave sram_memory.uas
set_instance_parameter_value cpu_1 setting_activateTrace true

add_instance jtag_uart_1 altera_avalon_jtag_uart 15.1
set_instance_parameter_value jtag_uart_1 simInteractiveOptions NO_INTERACTIVE_WINDOWS

add_instance read_dma_cb altera_msgdma 15.1
set_instance_parameter_value read_dma_cb BURST_ENABLE 1
set_instance_parameter_value read_dma_cb DATA_FIFO_DEPTH 512
set_instance_parameter_value read_dma_cb DATA_WIDTH 1024
set_instance_parameter_value read_dma_cb DESCRIPTOR_FIFO_DEPTH 16
set_instance_parameter_value read_dma_cb ENHANCED_FEATURES 0
set_instance_parameter_value read_dma_cb ERROR_ENABLE 0
set_instance_parameter_value read_dma_cb MAX_BURST_COUNT 4
set_instance_parameter_value read_dma_cb MAX_BYTE 1048576
set_instance_parameter_value read_dma_cb MODE 1
set_instance_parameter_value read_dma_cb PACKET_ENABLE 0
set_instance_parameter_value read_dma_cb TRANSFER_TYPE {Full Word Accesses Only}

add_instance byte_adapter_read_cb avalon_st_order_adapter 1.0
set_instance_parameter_value byte_adapter_read_cb Width 1024

add_instance mailbox_simple_0_1 altera_avalon_mailbox_simple 15.1
set_instance_parameter_value mailbox_simple_0_1 AWIDTH 2
set_instance_parameter_value mailbox_simple_0_1 DWIDTH 32
set_instance_parameter_value mailbox_simple_0_1 MSG_ARRIVAL_NOTIFY 1
set_instance_parameter_value mailbox_simple_0_1 MSG_SPACE_NOTIFY 0

add_instance mailbox_simple_1_0 altera_avalon_mailbox_simple 15.1
set_instance_parameter_value mailbox_simple_1_0 AWIDTH 2
set_instance_parameter_value mailbox_simple_1_0 DWIDTH 32
set_instance_parameter_value mailbox_simple_1_0 MSG_ARRIVAL_NOTIFY 1
set_instance_parameter_value mailbox_simple_1_0 MSG_SPACE_NOTIFY 0

add_instance mpeg_accel_0 mpeg_accel 1.0

add_instance read_dma_cr altera_msgdma 15.1
set_instance_parameter_value read_dma_cr BURST_ENABLE 1
set_instance_parameter_value read_dma_cr DATA_FIFO_DEPTH 512
set_instance_parameter_value read_dma_cr DATA_WIDTH 1024
set_instance_parameter_value read_dma_cr DESCRIPTOR_FIFO_DEPTH 16
set_instance_parameter_value read_dma_cr ENHANCED_FEATURES 0
set_instance_parameter_value read_dma_cr ERROR_ENABLE 0
set_instance_parameter_value read_dma_cr MAX_BURST_COUNT 4
set_instance_parameter_value read_dma_cr MAX_BYTE 1048576
set_instance_parameter_value read_dma_cr MODE 1
set_instance_parameter_value read_dma_cr PACKET_ENABLE 0
set_instance_parameter_value read_dma_cr TRANSFER_TYPE {Full Word Accesses Only}

add_instance byte_adapter_read_cr avalon_st_order_adapter 1.0
set_instance_parameter_value byte_adapter_read_cr Width 1024

add_instance cpu_1_bridge_0 altera_avalon_mm_bridge 15.1
set_instance_parameter_value cpu_1_bridge_0 ADDRESS_UNITS SYMBOLS
set_instance_parameter_value cpu_1_bridge_0 ADDRESS_WIDTH 10
set_instance_parameter_value cpu_1_bridge_0 DATA_WIDTH 32
set_instance_parameter_value cpu_1_bridge_0 MAX_PENDING_RESPONSES 4
set_instance_parameter_value cpu_1_bridge_0 USE_AUTO_ADDRESS_WIDTH 1

# connections
add_connection clk_50.out_clk sd_cont.clock clock
add_connection clk_50.out_clk sd_cont.sd_clk clock
add_connection clk_50.out_clk video_pll.refclk clock
add_connection clk_125.clk button_pio.clk clock
add_connection clk_125.clk byte_adapter_read_cb.clock clock
add_connection clk_125.clk byte_adapter_read_cr.clock clock
add_connection clk_125.clk byte_adapter_read_y.clock clock
add_connection clk_125.clk byte_adapter_write.clock clock
add_connection clk_125.clk cpu_0.clk clock
add_connection clk_125.clk cpu_0_bridge.clk clock
add_connection clk_125.clk cpu_1.clk clock
add_connection clk_125.clk cpu_1_bridge_0.clk clock
add_connection clk_125.clk dma_reset.clk clock
add_connection clk_125.clk i2c_scl.clk clock
add_connection clk_125.clk i2c_sda.clk clock
add_connection clk_125.clk jtag_uart_0.clk clock
add_connection clk_125.clk jtag_uart_1.clk clock
add_connection clk_125.clk key.clk clock
add_connection clk_125.clk ledg.clk clock
add_connection clk_125.clk ledr.clk clock
add_connection clk_125.clk lpddr2.mp_cmd_clk_0 clock
add_connection clk_125.clk lpddr2.mp_cmd_clk_1 clock
add_connection clk_125.clk lpddr2.mp_cmd_clk_2 clock
add_connection clk_125.clk lpddr2.mp_rfifo_clk_0 clock
add_connection clk_125.clk lpddr2.mp_rfifo_clk_1 clock
add_connection clk_125.clk lpddr2.mp_rfifo_clk_2 clock
add_connection clk_125.clk lpddr2.mp_rfifo_clk_3 clock
add_connection clk_125.clk lpddr2.mp_wfifo_clk_0 clock
add_connection clk_125.clk lpddr2.mp_wfifo_clk_1 clock
add_connection clk_125.clk lpddr2.mp_wfifo_clk_2 clock
add_connection clk_125.clk lpddr2.mp_wfifo_clk_3 clock
add_connection clk_125.clk mailbox_simple_0_1.clk clock
add_connection clk_125.clk mailbox_simple_1_0.clk clock
add_connection clk_125.clk mpeg_accel_0.clock_sink clock
add_connection clk_125.clk read_dma_cb.clock clock
add_connection clk_125.clk read_dma_cr.clock clock
add_connection clk_125.clk read_dma_y.clock clock
add_connection clk_125.clk sram.clk clock
add_connection clk_125.clk sysid.clk clock
add_connection clk_125.clk timer_0.clk clock
add_connection clk_125.clk timer_1.clk clock
add_connection clk_125.clk video_dma.clock clock
add_connection clk_125.clk video_fifo.clk_in clock
add_connection clk_125.clk write_dma.clock clock
add_connection video_pll.outclk0 pixel_conv.clk clock
add_connection video_pll.outclk0 video.clk clock
add_connection video_pll.outclk0 video_clk.in_clk clock
add_connection video_pll.outclk0 video_fifo.clk_out clock
add_connection clk_125.clk_reset button_pio.reset reset
add_connection clk_125.clk_reset cpu_0.reset reset
add_connection clk_125.clk_reset cpu_0_bridge.reset reset
add_connection clk_125.clk_reset cpu_1.reset reset
add_connection clk_125.clk_reset cpu_1_bridge_0.reset reset
add_connection clk_125.clk_reset i2c_scl.reset reset
add_connection clk_125.clk_reset i2c_sda.reset reset
add_connection clk_125.clk_reset jtag_uart_0.reset reset
add_connection clk_125.clk_reset jtag_uart_1.reset reset
add_connection clk_125.clk_reset key.reset reset
add_connection clk_125.clk_reset ledg.reset reset
add_connection clk_125.clk_reset ledr.reset reset
add_connection clk_125.clk_reset lpddr2.global_reset reset
add_connection clk_125.clk_reset lpddr2.mp_cmd_reset_n_0 reset
add_connection clk_125.clk_reset lpddr2.mp_cmd_reset_n_1 reset
add_connection clk_125.clk_reset lpddr2.mp_cmd_reset_n_2 reset
add_connection clk_125.clk_reset lpddr2.mp_rfifo_reset_n_0 reset
add_connection clk_125.clk_reset lpddr2.mp_rfifo_reset_n_1 reset
add_connection clk_125.clk_reset lpddr2.mp_rfifo_reset_n_2 reset
add_connection clk_125.clk_reset lpddr2.mp_rfifo_reset_n_3 reset
add_connection clk_125.clk_reset lpddr2.mp_wfifo_reset_n_0 reset
add_connection clk_125.clk_reset lpddr2.mp_wfifo_reset_n_1 reset
add_connection clk_125.clk_reset lpddr2.mp_wfifo_reset_n_2 reset
add_connection clk_125.clk_reset lpddr2.mp_wfifo_reset_n_3 reset
add_connection clk_125.clk_reset lpddr2.soft_reset reset
add_connection clk_125.clk_reset mailbox_simple_0_1.rst_n reset
add_connection clk_125.clk_reset mailbox_simple_1_0.rst_n reset
add_connection clk_125.clk_reset mpeg_accel_0.reset reset
add_connection clk_125.clk_reset pixel_conv.clk_reset reset
add_connection clk_125.clk_reset sd_cont.reset reset
add_connection clk_125.clk_reset sram.reset reset
add_connection clk_125.clk_reset sysid.reset reset
add_connection clk_125.clk_reset timer_0.reset reset
add_connection clk_125.clk_reset timer_1.reset reset
add_connection clk_125.clk_reset video.clk_reset reset
add_connection clk_125.clk_reset video_fifo.reset_in reset
add_connection clk_125.clk_reset video_fifo.reset_out reset
add_connection clk_125.clk_reset video_pll.reset reset
add_connection cpu_0.debug_reset_request cpu_0.reset reset
add_connection cpu_0.debug_reset_request cpu_0_bridge.reset reset
add_connection cpu_0.debug_reset_request jtag_uart_0.reset reset
add_connection cpu_0.debug_reset_request sram.reset reset
add_connection cpu_0.debug_reset_request video_dma.reset_n reset
add_connection cpu_1.debug_reset_request cpu_1.reset reset
add_connection dma_reset.out_reset byte_adapter_read_cb.reset reset
add_connection dma_reset.out_reset byte_adapter_read_cr.reset reset
add_connection dma_reset.out_reset byte_adapter_read_y.reset reset
add_connection dma_reset.out_reset byte_adapter_write.reset reset
add_connection dma_reset.out_reset read_dma_cb.reset_n reset
add_connection dma_reset.out_reset read_dma_cr.reset_n reset
add_connection dma_reset.out_reset read_dma_y.reset_n reset
add_connection dma_reset.out_reset video_dma.reset_n reset
add_connection dma_reset.out_reset write_dma.reset_n reset
add_connection lpddr2.afi_reset lpddr2.mp_rfifo_reset_n_0 reset
add_connection cpu_0.data_master cpu_0.debug_mem_slave avalon
set_connection_parameter_value cpu_0.data_master/cpu_0.debug_mem_slave baseAddress 0x21100800
add_connection cpu_0.data_master cpu_0_bridge.s0 avalon
set_connection_parameter_value cpu_0.data_master/cpu_0_bridge.s0 baseAddress 0x20000000
add_connection cpu_0.data_master jtag_uart_0.avalon_jtag_slave avalon
set_connection_parameter_value cpu_0.data_master/jtag_uart_0.avalon_jtag_slave baseAddress 0x21101008
add_connection cpu_0.data_master lpddr2.avl_0 avalon
set_connection_parameter_value cpu_0.data_master/lpddr2.avl_0 baseAddress 0x0000
add_connection cpu_0.data_master sram.uas avalon
set_connection_parameter_value cpu_0.data_master/sram.uas baseAddress 0x21080000
add_connection cpu_0.data_master sysid.control_slave avalon
set_connection_parameter_value cpu_0.data_master/sysid.control_slave baseAddress 0x21101000
add_connection cpu_0.instruction_master cpu_0.debug_mem_slave avalon
set_connection_parameter_value cpu_0.instruction_master/cpu_0.debug_mem_slave baseAddress 0x21100800
add_connection cpu_0.instruction_master sram.uas avalon
set_connection_parameter_value cpu_0.instruction_master/sram.uas baseAddress 0x21080000
add_connection cpu_0_bridge.m0 button_pio.s1 avalon
set_connection_parameter_value cpu_0_bridge.m0/button_pio.s1 baseAddress 0x0540
add_connection cpu_0_bridge.m0 i2c_scl.s1 avalon
set_connection_parameter_value cpu_0_bridge.m0/i2c_scl.s1 baseAddress 0x0560
add_connection cpu_0_bridge.m0 i2c_sda.s1 avalon
set_connection_parameter_value cpu_0_bridge.m0/i2c_sda.s1 baseAddress 0x0550
add_connection cpu_0_bridge.m0 key.s1 avalon
set_connection_parameter_value cpu_0_bridge.m0/key.s1 baseAddress 0x0570
add_connection cpu_0_bridge.m0 ledg.s1 avalon
set_connection_parameter_value cpu_0_bridge.m0/ledg.s1 baseAddress 0x0480
add_connection cpu_0_bridge.m0 ledr.s1 avalon
set_connection_parameter_value cpu_0_bridge.m0/ledr.s1 baseAddress 0x04a0
add_connection cpu_0_bridge.m0 mailbox_simple_0_1.avmm_msg_sender avalon
set_connection_parameter_value cpu_0_bridge.m0/mailbox_simple_0_1.avmm_msg_sender baseAddress 0x0500
add_connection cpu_0_bridge.m0 mailbox_simple_1_0.avmm_msg_receiver avalon
set_connection_parameter_value cpu_0_bridge.m0/mailbox_simple_1_0.avmm_msg_receiver baseAddress 0x0510
add_connection cpu_0_bridge.m0 read_dma_y.csr avalon
set_connection_parameter_value cpu_0_bridge.m0/read_dma_y.csr baseAddress 0x0460
add_connection cpu_0_bridge.m0 read_dma_y.descriptor_slave avalon
set_connection_parameter_value cpu_0_bridge.m0/read_dma_y.descriptor_slave baseAddress 0x0530
add_connection cpu_0_bridge.m0 sd_cont.slave avalon
set_connection_parameter_value cpu_0_bridge.m0/sd_cont.slave baseAddress 0x0000
add_connection cpu_0_bridge.m0 timer_0.s1 avalon
set_connection_parameter_value cpu_0_bridge.m0/timer_0.s1 baseAddress 0x04c0
add_connection cpu_0_bridge.m0 timer_1.s1 avalon
set_connection_parameter_value cpu_0_bridge.m0/timer_1.s1 baseAddress 0x0400
add_connection cpu_0_bridge.m0 video_dma.csr avalon
set_connection_parameter_value cpu_0_bridge.m0/video_dma.csr baseAddress 0x04e0
add_connection cpu_0_bridge.m0 video_dma.descriptor_slave avalon
set_connection_parameter_value cpu_0_bridge.m0/video_dma.descriptor_slave baseAddress 0x0580
add_connection cpu_0_bridge.m0 write_dma.csr avalon
set_connection_parameter_value cpu_0_bridge.m0/write_dma.csr baseAddress 0x0440
add_connection cpu_0_bridge.m0 write_dma.descriptor_slave avalon
set_connection_parameter_value cpu_0_bridge.m0/write_dma.descriptor_slave baseAddress 0x0520
add_connection cpu_1.data_master cpu_1.debug_mem_slave avalon
set_connection_parameter_value cpu_1.data_master/cpu_1.debug_mem_slave baseAddress 0x21000800
add_connection cpu_1.data_master cpu_1_bridge_0.s0 avalon
set_connection_parameter_value cpu_1.data_master/cpu_1_bridge_0.s0 baseAddress 0x20000000
add_connection cpu_1.data_master jtag_uart_1.avalon_jtag_slave avalon
set_connection_parameter_value cpu_1.data_master/jtag_uart_1.avalon_jtag_slave baseAddress 0x21001000
add_connection cpu_1.data_master lpddr2.avl_2 avalon
set_connection_parameter_value cpu_1.data_master/lpddr2.avl_2 baseAddress 0x0000
add_connection cpu_1.data_master sram.uas avalon
set_connection_parameter_value cpu_1.data_master/sram.uas baseAddress 0x21080000
add_connection cpu_1.instruction_master cpu_1.debug_mem_slave avalon
set_connection_parameter_value cpu_1.instruction_master/cpu_1.debug_mem_slave baseAddress 0x21000800
add_connection cpu_1.instruction_master sram.uas avalon
set_connection_parameter_value cpu_1.instruction_master/sram.uas baseAddress 0x21080000
add_connection cpu_1_bridge_0.m0 mailbox_simple_0_1.avmm_msg_receiver avalon
set_connection_parameter_value cpu_1_bridge_0.m0/mailbox_simple_0_1.avmm_msg_receiver baseAddress 0x0050
add_connection cpu_1_bridge_0.m0 mailbox_simple_1_0.avmm_msg_sender avalon
set_connection_parameter_value cpu_1_bridge_0.m0/mailbox_simple_1_0.avmm_msg_sender baseAddress 0x0060
add_connection cpu_1_bridge_0.m0 read_dma_cb.csr avalon
set_connection_parameter_value cpu_1_bridge_0.m0/read_dma_cb.csr baseAddress 0x0000
add_connection cpu_1_bridge_0.m0 read_dma_cb.descriptor_slave avalon
set_connection_parameter_value cpu_1_bridge_0.m0/read_dma_cb.descriptor_slave baseAddress 0x0040
add_connection cpu_1_bridge_0.m0 read_dma_cr.csr avalon
set_connection_parameter_value cpu_1_bridge_0.m0/read_dma_cr.csr baseAddress 0x0020
add_connection cpu_1_bridge_0.m0 read_dma_cr.descriptor_slave avalon
set_connection_parameter_value cpu_1_bridge_0.m0/read_dma_cr.descriptor_slave baseAddress 0x0070
add_connection read_dma_cb.mm_read lpddr2.avl_1 avalon
set_connection_parameter_value read_dma_cb.mm_read/lpddr2.avl_1 baseAddress 0x0000
add_connection read_dma_cr.mm_read lpddr2.avl_1 avalon
set_connection_parameter_value read_dma_cr.mm_read/lpddr2.avl_1 baseAddress 0x0000
add_connection read_dma_y.mm_read lpddr2.avl_1 avalon
set_connection_parameter_value read_dma_y.mm_read/lpddr2.avl_1 baseAddress 0x0000
add_connection sd_cont.master lpddr2.avl_0 avalon
set_connection_parameter_value sd_cont.master/lpddr2.avl_0 baseAddress 0x0000
add_connection video_dma.mm_read lpddr2.avl_1 avalon
set_connection_parameter_value video_dma.mm_read/lpddr2.avl_1 baseAddress 0x0000
add_connection write_dma.mm_write lpddr2.avl_1 avalon
set_connection_parameter_value write_dma.mm_write/lpddr2.avl_1 baseAddress 0x0000
add_connection byte_adapter_read_cb.src mpeg_accel_0.src_cb avalon_streaming
add_connection byte_adapter_read_cr.src mpeg_accel_0.src_cr avalon_streaming
add_connection byte_adapter_read_y.src mpeg_accel_0.src_y avalon_streaming
add_connection byte_adapter_write.src write_dma.st_sink avalon_streaming
add_connection mpeg_accel_0.dst byte_adapter_write.sink avalon_streaming
add_connection pixel_conv.out video.in avalon_streaming
add_connection read_dma_cb.st_source byte_adapter_read_cb.sink avalon_streaming
add_connection read_dma_cr.st_source byte_adapter_read_cr.sink avalon_streaming
add_connection read_dma_y.st_source byte_adapter_read_y.sink avalon_streaming
add_connection video_dma.st_source video_fifo.in avalon_streaming
add_connection video_fifo.out pixel_conv.in avalon_streaming
add_connection cpu_0.irq button_pio.irq interrupt
set_connection_parameter_value cpu_0.irq/button_pio.irq irqNumber 5
add_connection cpu_0.irq jtag_uart_0.irq interrupt
set_connection_parameter_value cpu_0.irq/jtag_uart_0.irq irqNumber 1
add_connection cpu_0.irq key.irq interrupt
set_connection_parameter_value cpu_0.irq/key.irq irqNumber 2
add_connection cpu_0.irq mailbox_simple_1_0.interrupt_msg_pending interrupt
set_connection_parameter_value cpu_0.irq/mailbox_simple_1_0.interrupt_msg_pending irqNumber 8
add_connection cpu_0.irq read_dma_y.csr_irq interrupt
set_connection_parameter_value cpu_0.irq/read_dma_y.csr_irq irqNumber 6
add_connection cpu_0.irq timer_0.irq interrupt
set_connection_parameter_value cpu_0.irq/timer_0.irq irqNumber 0
add_connection cpu_0.irq timer_1.irq interrupt
set_connection_parameter_value cpu_0.irq/timer_1.irq irqNumber 4
add_connection cpu_0.irq video_dma.csr_irq interrupt
set_connection_parameter_value cpu_0.irq/video_dma.csr_irq irqNumber 3
add_connection cpu_0.irq write_dma.csr_irq interrupt
set_connection_parameter_value cpu_0.irq/write_dma.csr_irq irqNumber 7
add_connection cpu_1.irq jtag_uart_1.irq interrupt
set_connection_parameter_value cpu_1.irq/jtag_uart_1.irq irqNumber 0
add_connection cpu_1.irq mailbox_simple_0_1.interrupt_msg_pending interrupt
set_connection_parameter_value cpu_1.irq/mailbox_simple_0_1.interrupt_msg_pending irqNumber 3
add_connection cpu_1.irq read_dma_cb.csr_irq interrupt
set_connection_parameter_value cpu_1.irq/read_dma_cb.csr_irq irqNumber 1
add_connection cpu_1.irq read_dma_cr.csr_irq interrupt
set_connection_parameter_value cpu_1.irq/read_dma_cr.csr_irq irqNumber 2

# exported interfaces
add_interface button_pio conduit end
set_interface_property button_pio EXPORT_OF button_pio.external_connection
add_interface clk_125 clock sink
set_interface_property clk_125 EXPORT_OF clk_125.clk_in
add_interface clk_50 clock sink
set_interface_property clk_50 EXPORT_OF clk_50.in_clk
add_interface cpu_0_reset conduit end
set_interface_property cpu_0_reset EXPORT_OF cpu_0.cpu_resetrequest_conduit
add_interface cpu_1_reset conduit end
set_interface_property cpu_1_reset EXPORT_OF cpu_1.cpu_resetrequest_conduit
add_interface i2c_scl conduit end
set_interface_property i2c_scl EXPORT_OF i2c_scl.external_connection
add_interface i2c_sda conduit end
set_interface_property i2c_sda EXPORT_OF i2c_sda.external_connection
add_interface key conduit end
set_interface_property key EXPORT_OF key.external_connection
add_interface ledg conduit end
set_interface_property ledg EXPORT_OF ledg.external_connection
add_interface ledr conduit end
set_interface_property ledr EXPORT_OF ledr.external_connection
add_interface lpddr2 conduit end
set_interface_property lpddr2 EXPORT_OF lpddr2.memory
add_interface lpddr2_oct conduit end
set_interface_property lpddr2_oct EXPORT_OF lpddr2.oct
add_interface lpddr2_pll_ref_clk clock sink
set_interface_property lpddr2_pll_ref_clk EXPORT_OF lpddr2.pll_ref_clk
add_interface lpddr2_pll_sharing conduit end
set_interface_property lpddr2_pll_sharing EXPORT_OF lpddr2.pll_sharing
add_interface lpddr2_status conduit end
set_interface_property lpddr2_status EXPORT_OF lpddr2.status
add_interface reset reset sink
set_interface_property reset EXPORT_OF clk_125.clk_in_reset
add_interface reset_bridge reset sink
set_interface_property reset_bridge EXPORT_OF dma_reset.in_reset
add_interface sd conduit end
set_interface_property sd EXPORT_OF sd_cont.sd
add_interface sram conduit end
set_interface_property sram EXPORT_OF sram.bridge
add_interface video conduit end
set_interface_property video EXPORT_OF video.sync
add_interface video_clk clock source
set_interface_property video_clk EXPORT_OF video_clk.out_clk

set_interconnect_requirement {$system} qsys_mm.clockCrossingAdapter AUTO
set_interconnect_requirement {$system} qsys_mm.maxAdditionalLatency 4

save_system ECE423_QSYS.qsys
